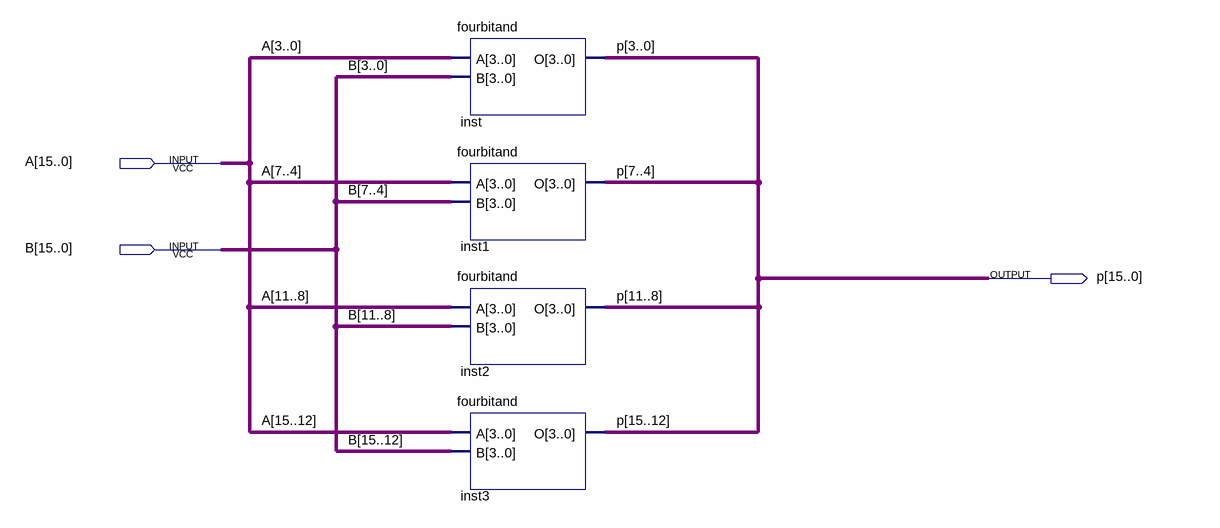
[diagram p0: schematic sheet]
// Quartus schematic onesixand.bdf as structural Verilog: 4 symbols, 3 pins
module onesixand (
  input  [15:0] A,
  input  [15:0] B,
  output [15:0] p
);

  fourbitand inst (.A(A[3:0]), .B(B[3:0]), .O(p[3:0]));
  fourbitand inst1 (.A(A[7:4]), .B(B[7:4]), .O(p[7:4]));
  fourbitand inst2 (.A(A[11:8]), .B(B[11:8]), .O(p[11:8]));
  fourbitand inst3 (.A(A[15:12]), .B(B[15:12]), .O(p[15:12]));
endmodule
